# Altium schematic sheet Schematic.SchDoc
size A; SheetNumber: 1; SheetTotal: 1
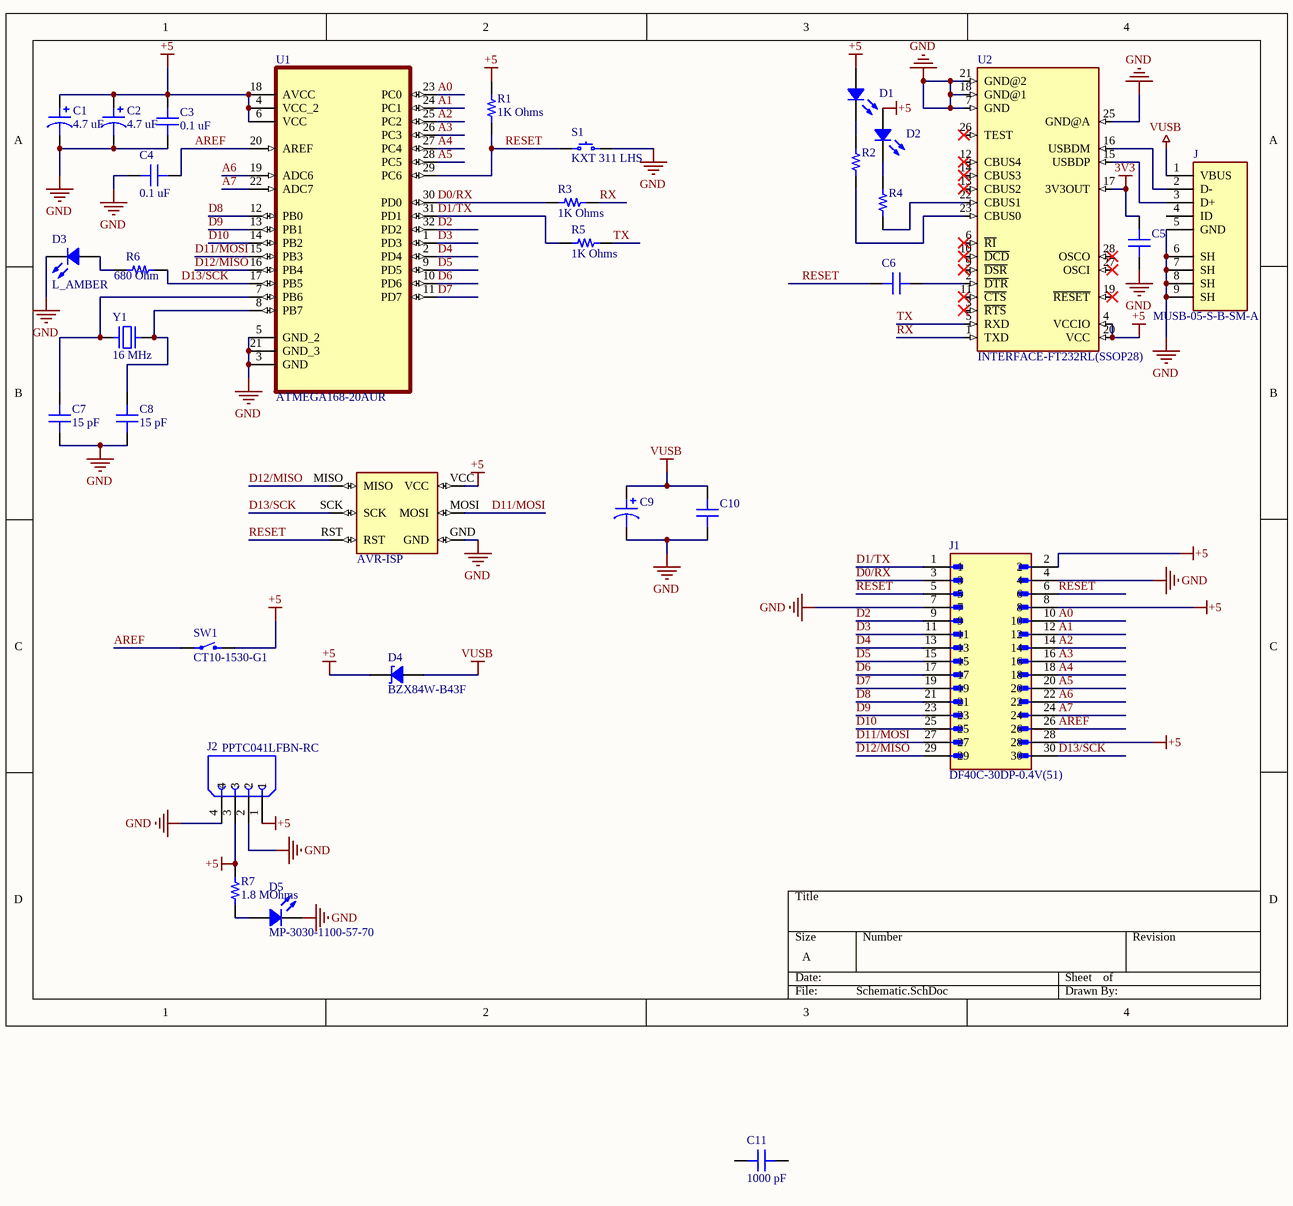
[diagram p0: Schematic.SchDoc]

## Parts
?  AVR-ISP  [AVR-ISP]
C1  4.7 uF  [CAP ALSMD 4.3MM H5.4MM]
C2  4.7 uF  [CAP ALSMD 4.3MM H5.4MM]
C3  Capacitance: 0.1 uF  [CAP 1206_3216 - 0.8MM]  (hidden comment: 1000 pF)
C4  Capacitance: 0.1 uF  [CAP 1206_3216 - 0.8MM]  (hidden comment: 1000 pF)
C5  1000 pF  [CAP 1206_3216 - 0.8MM]  (value not drawn)
C6  1000 pF  [CAP 1206_3216 - 0.8MM]  (value not drawn)
C7  Capacitance: 15 pF  [CAP 1206_3216 - 0.8MM]  (hidden comment: 1000 pF)
C8  Capacitance: 15 pF  [CAP 1206_3216 - 0.8MM]  (hidden comment: 1000 pF)
C9  (no value)  [CAP ALSMD 4.3MM H5.4MM]
C10  1000 pF  [CAP 1206_3216 - 0.8MM]  (value not drawn)
C11  1000 pF  [CAP 1206_3216 - 0.8MM]
D1  (no value)  [LUMINUS MP-3030-110]
D2  (no value)  [LUMINUS MP-3030-110]
D3  L_AMBER  [LUMINUS MP-3030-110]
D4  BZX84W-B43F  [DIODES SOT-323-3]
D5  MP-3030-1100-57-70  [LUMINUS MP-3030-110]
J  MUSB-05-S-B-SM-A  [SAMTEC_MUSB-05-S-B-SM-A]
J1  DF40C-30DP-0.4V(51)  [HRS_DF40C-30DP-0.4V(51)]
J2  PPTC041LFBN-RC  [SULLINS_PPTC041LFBN-RC]
R1  1K Ohms  [RES 0805_2012]
R2  (no value)  [RES 0805_2012]
R3  1K Ohms  [RES 0805_2012]
R4  (no value)  [RES 0805_2012]
R5  1K Ohms  [RES 0805_2012]
R6  680 Ohm  [RES 0805_2012]
R7  1.8 MOhms  [RES 0805_2012]
S1  KXT 311 LHS  [C&K KXT3]
SW1  CT10-1530-G1  [COTO TECHNOLOGY - CT10 G1]
U1  ATMEGA168-20AUR  [QFP80P900X900X120-32N]
U2  INTERFACE-FT232RL(SSOP28)  [SSOP28-0.65-10.2X5.2MM]
Y1  16 MHz  [ABRACON ABLS]

## Nets
3V3: C5.2 U2.17(3V3OUT)
+5: ?.VCC C1.1 C2.1 C3.2 D1.1 D2.1 D4.2 J1.2 J1.8 J1.28 J2.1 J2.3 R1.1 R7.2 SW1.2 U1.4(VCC_2) U1.6(VCC) U1.18(AVCC) U2.4(VCCIO) U2.20(VCC)
GND: ?.GND C1.2 C2.2 C3.1 C4.2 C5.1 C7.1 C8.1 C9.2 C10.2 D3.2 D5.2 J.5(GND) J.6(SH) J.7(SH) J.8(SH) J.9(SH) J1.4 J1.7 J2.2 J2.4 S1.2 U1.3(GND) U1.5(GND_2) U1.21(GND_3) U2.7(GND) U2.18(GND@1) U2.21(GND@2) U2.25(GND@A)
VUSB: C9.1 C10.1 D4.1 J.1(VBUS)
A0: J1.10 U1.23(PC0)
A1: J1.12 U1.24(PC1)
A2: J1.14 U1.25(PC2)
A3: J1.16 U1.26(PC3)
A4: J1.18 U1.27(PC4)
A5: J1.20 U1.28(PC5)
A6: J1.22 U1.19(ADC6)
A7: J1.24 U1.22(ADC7)
AREF: C4.1 J1.26 SW1.1 U1.20(AREF)
D0/RX: J1.3 R3.1 U1.30(PD0)
D1/TX: J1.1 R5.1 U1.31(PD1)
D2: J1.9 U1.32(PD2)
D3: J1.11 U1.1(PD3)
D4: J1.13 U1.2(PD4)
D5: J1.15 U1.9(PD5)
D6: J1.17 U1.10(PD6)
D7: J1.19 U1.11(PD7)
D8: J1.21 U1.12(PB0)
D9: J1.23 U1.13(PB1)
D10: J1.25 U1.14(PB2)
D11/MOSI: ?.MOSI J1.27 U1.15(PB3)
D12/MISO: ?.MISO J1.29 U1.16(PB4)
D13/SCK: ?.SCK J1.30 R6.1 U1.17(PB5)
RESET: ?.RST C6.2 J1.5 J1.6 R1.2 S1.1 U1.29(PC6)
RX: R3.2 U2.1(TXD)
TX: R5.2 U2.5(RXD)
NetC6_1: C6.1 U2.2(~{DTR})
NetC7_2: C7.2 U1.7(PB6) Y1.1
NetC8_2: C8.2 U1.8(PB7) Y1.2
NetD1_2: D1.2 R2.1
NetD2_2: D2.2 R4.2
NetD3_1: D3.1 R6.2
NetD5_1: D5.1 R7.1
NetJ_2: J.2(D-) U2.16(USBDM)
NetJ_3: J.3(D+) U2.15(USBDP)
NetR2_2: R2.2 U2.23(CBUS0)
NetR4_1: R4.1 U2.22(CBUS1)

Not connected (* = marked no-connect by the designer): C11 1 2; J 4(ID); U2 3(~{RTS})* 6(~{RI})* 9(~{DSR})* 10(~{DCD})* 11(~{CTS})* 12(CBUS4)* 13(CBUS2)* 14(CBUS3)* 19(~{RESET})* 26(TEST)* 27(OSCI)* 28(OSCO)*

## Library data of the parts
? = AVR-ISP: Emulators / Simulators AVR USB IN CIRCUIT EMUL/PRGMR ISP; MF: Gravitech; SnapEDA_Link: https://www.snapeda.com/parts/AVR-ISP/Gravitech/view-part/4593377/?ref=snap; MP: AVR-ISP; Availability: Unavailable; Price: None; Value: *; Package: None
C1 C2 C9 = UWX1C100MCL1GB: CAP ALUM 10UF 20% 16V SMD; manufacturer: Nichicon; Capacitance: 10 µF; Lifetime @ Temp.: 2000 Hrs @ 85°C; Polarization: Polar; Ripple Current @ High Frequency: 34.5 mA @ 10 kHz; Ripple Current @ Low Frequency: 23 mA @ 120 Hz; Surface Mount Land Size: 0.169" L x 0.169" W (4.30mm x 4.30mm); value: 10 µF; Part Number: UWX1C100MCL1GB; Applications: General Purpose; componentlink1description: Datasheet; componentlink1url: https://products.nichicon.co.jp/en/pdf/XJA043/e-uwx.pdf; componentlink2description: DigiKey Link; componentlink2url: https://www.digikey.com/en/products/detail/nichicon/UWX1C100MCL1GB/589841; Device Package: Radial, Can - SMD; Height - Seated (Max): 0.213" (5.40mm); lastupdated: 6/3/2024 7:53:00 PM; Lifecycle Status: Active; Minimum Order: 1; Mounting Type: Surface Mount; Operating Temperature: -40°C ~ 85°C; Package / Case: Radial, Can - SMD; packaging: TapeAndReel; partid: 7030; Part Status: Active; price: 0.06; series: UWX; Size / Dimension: 0.157" Dia (4.00mm); Supplier 1: DigiKey; Supplier Part Number 1: 493-2100-1-ND; Tolerance: ±20%; Voltage - Rated: 16 V
C3-C8 C10 C11 = AC1206JRNPO9BN102: CAP CER 1000PF 50V C0G/NPO 1206; manufacturer: Yageo; Temperature Coefficient: C0G, NP0; Tolerance: ±5%; Part Number: AC1206JRNPO9BN102; Applications: Automotive; componentlink1description: Datasheet; componentlink1url: http://www.yageo.com/NewPortal/_en/search/productDocs.jsp?YageoPartNumber=AC1206JRNPO9BN102; componentlink2description: DigiKey Link; componentlink2url: https://www.digikey.com/en/products/detail/yageo/AC1206JRNPO9BN102/6643188; Device Package: 1206 (3216 Metric); lastupdated: 6/4/2024 7:10:41 PM; Lifecycle Status: Active; Minimum Order: 1; Mounting Type: Surface Mount, MLCC; Operating Temperature: -55°C ~ 125°C; Package / Case: 1206 (3216 Metric); packaging: TapeAndReel; partid: 18692; Part Status: Active; price: 0.05; Ratings: AEC-Q200; series: AC; Size / Dimension: 0.126" L x 0.063" W (3.20mm x 1.60mm); Supplier 1: DigiKey; Supplier Part Number 1: 311-3202-1-ND; Thickness (Max): 0.028" (0.70mm); value: 1000 pF; Voltage - Rated: 50V
  C11: Capacitance: 1000 pF
D1-D3 D5 = MP-3030-1100-57-70: LED MID PWR 5700K 70CRI 3030; Manufacturer: Luminus Devices Inc.; Color: White, Cool; CRI (Color Rendering Index): 70; Current - Max: 240mA; Current - Test: 150mA; Flux @ 25°C, Current - Test: 78lm (Typ); Lumens/Watt @ Current - Test: 173 lm/W; Viewing Angle: 110°; Voltage - Forward (Vf) (Typ): 3V; Part Number: MP-3030-1100-57-70; CCT (K): 5700K; ComponentLink1Description: Datasheet; ComponentLink1URL: https://download.luminus.com/datasheets/Luminus_MP3030_1100_Datasheet.pdf; ComponentLink2Description: DigiKey Link; ComponentLink2URL: https://www.digikey.com/en/products/detail/luminus-devices-inc/MP-3030-1100-57-70/5731698; Device Package: 1212 (3030 Metric); Height - Seated (Max): 0.020" (0.52mm); LastUpdated: 6/3/2024 8:04:16 PM; Lifecycle Status: Active; Minimum Order: 1; Mounting Type: Surface Mount; Package / Case: 1212 (3030 Metric); Packaging: TapeAndReel; PartId: 16; Part Status: Active; Price: 0.05; Series: MP-3030; Size / Dimension: 0.118" L x 0.118" W (3.00mm x 3.00mm); Supplier 1: DigiKey; Supplier Part Number 1: 1214-1349-1-ND; Supplier Device Package: 3030
D4 = BZX84W-B43F: DIODE ZENER 43V 275MW SOT323; Part Number: BZX84W-B43F
J = MUSB-05-S-B-SM-A: USB - mini B USB 2.0 Priz KonektÃ¶rÃ¼ 5 Pozisyon YÃ¼zeye Montaj, Dik AÃ§Ä±; MF: Samtec; MP: MUSB-05-S-B-SM-A; Availability: Unavailable; Package: None; Value: *; Price: None; SnapEDA_Link: https://www.snapeda.com/parts/MUSB-05-S-B-SM-A/Samtec%20Inc./view-part/227451/?ref=snap
J1 = DF40C-30DP-0.4V(51): 30 Position Connector Plug, Outer Shroud Contacts Surface Mount Gold; MF: Hirose Electric; Package: None; Price: None; Check_prices: https://www.snapeda.com/parts/DF40C-30DP-0.4V(51)/Hirose+Electric+Co+Ltd/view-part/?ref=eda; Value: *; SnapEDA_Link: https://www.snapeda.com/parts/DF40C-30DP-0.4V(51)/Hirose+Electric+Co+Ltd/view-part/?ref=snap; MP: DF40C-30DP-0.4V(51); Availability: In Stock; Purchase-URL: https://pricing.snapeda.com/search?q=DF40C-30DP-0.4V(51)&ref=eda
J2 = PPTC041LFBN-RC: 4 Position Header Connector 0.100 (2.54mm) Through Hole Tin; MF: Sullins Connector; SnapEDA_Link: https://www.snapeda.com/parts/PPTC041LFBN-RC/Sullins/view-part/?ref=snap; Package: None; Value: *; MP: PPTC041LFBN-RC; Check_prices: https://www.snapeda.com/parts/PPTC041LFBN-RC/Sullins/view-part/?ref=eda
R1-R6 = RG2012P-185-B-T5: RES 1.8M OHM 0.1% 1/8W 0805; Manufacturer: Susumu; Power (Watts): 0.125W, 1/8W; Resistance: 1.8 MOhms; Temperature Coefficient: ±25ppm/°C; Part Number: RG2012P-185-B-T5; ComponentLink1Description: Datasheet; ComponentLink1URL: http://www.susumu.co.jp/common/pdf/n_catalog_partition01_en.pdf; ComponentLink2Description: DigiKey Link; ComponentLink2URL: https://www.digikey.com/en/products/detail/susumu/RG2012P-185-B-T5/7035370; Composition: Thin Film; Device Package: 0805 (2012 Metric); Features: Anti-Sulfur, Automotive AEC-Q200; Height - Seated (Max): 0.020" (0.50mm); LastUpdated: 2/8/2024 9:02:39 PM; Lifecycle Status: Active; Minimum Order: 1; Number of Terminations: 2; Operating Temperature: -55°C ~ 155°C; Package / Case: 0805 (2012 Metric); Packaging: TapeAndReel; PartId: 27693; Part Status: Active; Price: 0.07; Ratings: AEC-Q200; Series: RG; Size / Dimension: 0.079" L x 0.049" W (2.00mm x 1.25mm); Supplier 1: DigiKey; Supplier Part Number 1: 408-2026-1-ND; Supplier Device Package: 0805; Tolerance: ±0.1%
  R1 R3 R5: Value: 1K Ohms
R7 = RG2012P-185-B-T5: RES 1.8M OHM 0.1% 1/8W 0805; Manufacturer: Susumu; Power (Watts): 0.125W, 1/8W; Temperature Coefficient: ±25ppm/°C; Part Number: RG2012P-185-B-T5; Value: 1.8 MOhms; ComponentLink1Description: Datasheet; ComponentLink1URL: http://www.susumu.co.jp/common/pdf/n_catalog_partition01_en.pdf; ComponentLink2Description: DigiKey Link; ComponentLink2URL: https://www.digikey.com/en/products/detail/susumu/RG2012P-185-B-T5/7035370; Composition: Thin Film; Device Package: 0805 (2012 Metric); Features: Anti-Sulfur, Automotive AEC-Q200; Height - Seated (Max): 0.020" (0.50mm); LastUpdated: 2/8/2024 9:02:39 PM; Lifecycle Status: Active; Minimum Order: 1; Number of Terminations: 2; Operating Temperature: -55°C ~ 155°C; Package / Case: 0805 (2012 Metric); Packaging: TapeAndReel; PartId: 27693; Part Status: Active; Price: 0.07; Ratings: AEC-Q200; Resistance: 1.8 MOhms; Series: RG; Size / Dimension: 0.079" L x 0.049" W (2.00mm x 1.25mm); Supplier 1: DigiKey; Supplier Part Number 1: 408-2026-1-ND; Supplier Device Package: 0805; Tolerance: ±0.1%
S1 = KXT 311 LHS: SWITCH TACTILE SPST-NO 0.02A 15V; Manufacturer: C&K; Actuator Height off PCB, Vertical: 0.60mm; Actuator Orientation: Top Actuated; Actuator Type: Standard; Contact Rating @ Voltage: 0.02A @ 15VDC; Illumination: Non-Illuminated; Operating Force: 100gf; Outline: 3.00mm x 2.00mm; Switch Function: Off-Mom; Part Number: KXT 311 LHS; Circuit: SPST-NO; ComponentLink1Description: Datasheet; ComponentLink1URL: https://dznh3ojzb2azq.cloudfront.net/products/Tactile/KXT3/documents/datasheet.pdf; ComponentLink2Description: DigiKey Link; ComponentLink2URL: https://www.digikey.com/en/products/detail/c-k/KXT-311-LHS/6599752; LastUpdated: 6/3/2024 8:19:27 PM; Lifecycle Status: Active; Minimum Order: 1; Mounting Type: Surface Mount; Operating Temperature: -40°C ~ 85°C; Packaging: TapeAndReel; Part Status: Active; Price: 0.13; Series: KXT3; Supplier 1: DigiKey; Supplier Part Number 1: CKN10777CT-ND; Termination Style: SMD (SMT) Tab
SW1 = CT10-1530-G1: SWITCH REED SPST-NO 500MA 140V; Part Number: CT10-1530-G1
U1 = ATMEGA168-20AUR: AVR AVRÂ® ATmega Microcontroller IC 8-Bit 20MHz 16KB (8K x 16) FLASH 32-TQFP (7x7); MF: Microchip Technology; SnapEDA_Link: https://www.snapeda.com/parts/ATMEGA168-20AUR/Microchip/view-part/?ref=snap; Package: TQFP-32 Microchip; Value: *; MP: ATMEGA168-20AUR; Check_prices: https://www.snapeda.com/parts/ATMEGA168-20AUR/Microchip/view-part/?ref=eda
U2 = INTERFACE-FT232RL(SSOP28): USB Bridge, USB to UART USB 2.0 UART Interface 28-SSOP; MF: FTDI, Future; SnapEDA_Link: https://www.snapeda.com/parts/FT232RL/FTDI%252C+Future+Technology+Devices+International+Ltd/view-part/?ref=snap; Package: SSOP-28 FTDI; Value: *; MP: FT232RL; Check_prices: https://www.snapeda.com/parts/FT232RL/FTDI%252C+Future+Technology+Devices+International+Ltd/view-part/?ref=eda
Y1 = ABLS-37.500MHZ-12-1-U-F-T: CRYSTAL 37.5000MHZ 12PF SMD; Manufacturer: Abracon LLC; ESR (Equivalent Series Resistance): 80 Ohms; Frequency: 37.5 MHz; Frequency Stability: ±10ppm; Operating Mode: Fundamental; Value: 37.5 MHz; Part Number: ABLS-37.500MHZ-12-1-U-F-T; ComponentLink1Description: Datasheet; ComponentLink1URL: https://abracon.com/Resonators/abls.pdf; ComponentLink2Description: DigiKey Link; ComponentLink2URL: https://www.digikey.com/en/products/detail/abracon-llc/ABLS-37-500MHZ-12-1-U-F-T/2623659; Frequency Tolerance: ±10ppm; Height - Seated (Max): 0.165" (4.20mm); LastUpdated: 6/3/2024 8:02:03 PM; Lifecycle Status: Active; Load Capacitance: 12pF; Minimum Order: 1; Mounting Type: Surface Mount; Operating Temperature: 0°C ~ 60°C; Package / Case: HC-49/US; Packaging: CutTape; PartId: 6; Part Status: Active; Price: 1.58; Series: ABLS; Size / Dimension: 0.449" L x 0.185" W (11.40mm x 4.70mm); Supplier 1: DigiKey; Supplier Part Number 1: 535-10795-1-ND; Type: MHz Crystal